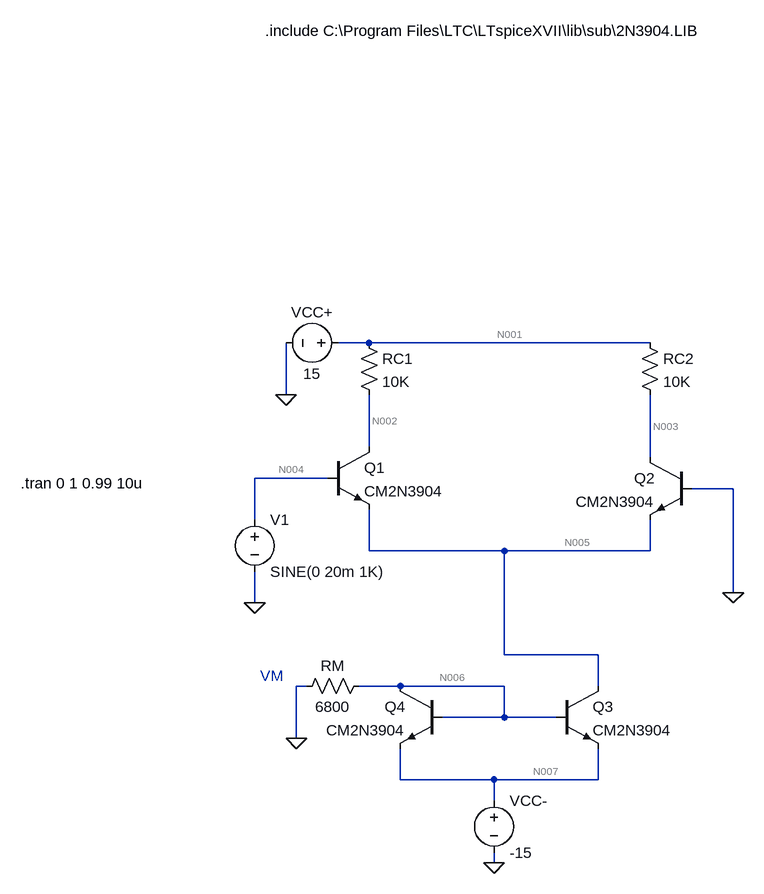
[diagram p0: schematic Part 3 differential amp saturation.asc]
Part 3 differential amp saturation.asc, the LTspice schematic file:
Version 4
SHEET 1 1088 1156
WIRE -96 272 -144 272
WIRE 336 272 -96 272
WIRE -224 352 -224 272
WIRE -96 432 -96 352
WIRE 336 448 336 352
WIRE -160 480 -272 480
WIRE 464 496 400 496
WIRE -272 544 -272 480
WIRE -96 592 -96 528
WIRE 112 592 -96 592
WIRE 336 592 336 544
WIRE 336 592 112 592
WIRE 464 656 464 496
WIRE -272 672 -272 624
WIRE 112 752 112 592
WIRE 256 752 112 752
WIRE -192 800 -208 800
WIRE -48 800 -112 800
WIRE 112 800 -48 800
WIRE 256 800 256 752
WIRE 112 848 112 800
WIRE 112 848 16 848
WIRE 192 848 112 848
WIRE -208 880 -208 800
WIRE -48 944 -48 896
WIRE 96 944 -48 944
WIRE 256 944 256 896
WIRE 256 944 96 944
WIRE 96 976 96 944
WIRE 96 1072 96 1056
FLAG -272 672 0
FLAG -208 880 0
FLAG 96 1072 0
FLAG -224 352 0
FLAG 464 656 0
SYMBOL voltage -128 272 R90
WINDOW 0 -32 56 VBottom 2
WINDOW 3 32 56 VTop 2
SYMATTR InstName VCC+
SYMATTR Value 15
SYMBOL res -112 256 R0
SYMATTR InstName RC1
SYMATTR Value 10K
SYMBOL res 320 256 R0
SYMATTR InstName RC2
SYMATTR Value 10K
SYMBOL npn -160 432 R0
SYMATTR InstName Q1
SYMATTR Value CM2N3904
SYMBOL npn 400 448 M0
SYMATTR InstName Q2
SYMATTR Value CM2N3904
SYMBOL npn 192 800 R0
SYMATTR InstName Q3
SYMATTR Value CM2N3904
SYMBOL npn 16 800 M0
SYMATTR InstName Q4
SYMATTR Value CM2N3904
SYMBOL res -96 784 R90
WINDOW 0 0 56 VBottom 2
WINDOW 3 32 56 VTop 2
SYMATTR InstName RM
SYMATTR Value 6800
SYMBOL voltage 96 960 R0
SYMATTR InstName VCC-
SYMATTR Value -15
SYMBOL voltage -272 528 R0
WINDOW 123 0 0 Left 0
WINDOW 39 0 0 Left 0
SYMATTR InstName V1
SYMATTR Value SINE(0 20m 1K)
TEXT -256 -208 Left 2 !.include C:\\Program Files\\LTC\\LTspiceXVII\\lib\\sub\\2N3904.LIB
TEXT -264 784 Left 2 ;VM
TEXT -632 488 Left 2 !.tran 0 1 0.99 10u

The netlist it stands for:
* Part 3 differential amp saturation.asc
VCC+ N001 0 15
RC1 N001 N002 10K
RC2 N001 N003 10K
Q1 N002 N004 N005 0 CM2N3904
Q2 N003 0 N005 0 CM2N3904
Q3 N005 N006 N007 0 CM2N3904
Q4 N006 N006 N007 0 CM2N3904
RM N006 0 6800
VCC- N007 0 -15
V1 N004 0 SINE(0 20m 1K)
.model NPN NPN
.model PNP PNP
.lib standard.bjt
.include C:\Program Files\LTC\LTspiceXVII\lib\sub\2N3904.LIB
* VM
.tran 0 1 0.99 10u
.backanno
.end

* Results of the author's LTspice run, read from the files saved beside the schematic
* Operating Point, zero values left out:
*   V(n001) = 15 V
*   V(n002) = 3.303 V
*   V(n003) = 3.303 V
*   V(n005) = -650.8 mV
*   V(n006) = -14.33 V
*   V(n007) = -15 V
*   Ic(Q4) = 2.075 mA
*   Ib(Q4) = 16.35 µA
*   Ie(Q4) = -2.091 mA
*   Ic(Q3) = 2.359 mA
*   Ib(Q3) = 16.35 µA
*   Ie(Q3) = -2.375 mA
*   Ic(Q2) = 1.17 mA
*   Ib(Q2) = 9.725 µA
*   Ie(Q2) = -1.179 mA
*   Ic(Q1) = 1.17 mA
*   Ib(Q1) = 9.725 µA
*   Ie(Q1) = -1.179 mA
*   I(Rm) = -2.108 mA
*   I(Rc2) = 1.17 mA
*   I(Rc1) = 1.17 mA
*   I(V1) = -9.725 µA
*   I(Vcc-) = 4.467 mA
*   I(Vcc+) = -2.339 mA
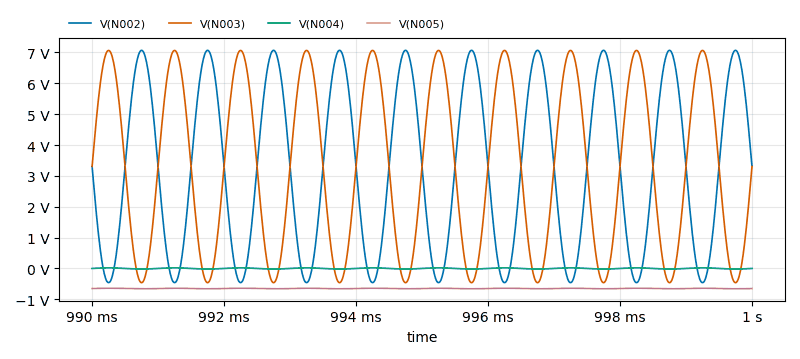
[diagram p1: Transient Analysis of Part 3 differential amp saturation.asc, plotted from the saved traces]
* Transient Analysis, 1 run:
*   V(N002): min -457.8 mV, max 7.068 V, average 3.303 V, rms 4.259 V, last 3.303 V
*   V(N003): min -459.1 mV, max 7.064 V, average 3.303 V, rms 4.258 V, last 3.302 V
*   V(N004): min -19.99 mV, max 19.99 mV, average -44.42 nV, rms 14.16 mV, last 0 V
*   V(N005): min -659.4 mV, max -639.4 mV, average -650.1 mV, rms 650.1 mV, last -650.8 mV